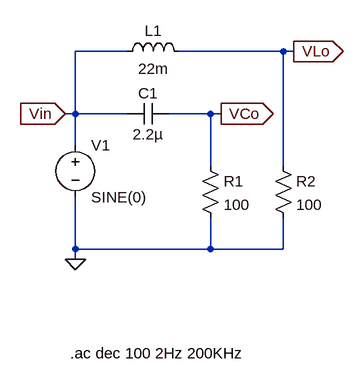
[diagram p0: schematic Passive Filters.asc]
Passive Filters.asc, the LTspice schematic file:
Version 4
SHEET 1 880 680
WIRE 208 128 128 128
WIRE 448 128 288 128
WIRE 464 128 448 128
WIRE 128 224 128 128
WIRE 128 224 112 224
WIRE 208 224 128 224
WIRE 336 224 272 224
WIRE 352 224 336 224
WIRE 128 272 128 224
WIRE 336 304 336 224
WIRE 448 304 448 128
WIRE 128 432 128 352
WIRE 336 432 336 384
WIRE 336 432 128 432
WIRE 448 432 448 384
WIRE 448 432 336 432
WIRE 128 448 128 432
FLAG 128 448 0
FLAG 352 224 VCo
IOPIN 352 224 Out
FLAG 464 128 VLo
IOPIN 464 128 Out
FLAG 112 224 Vin
IOPIN 112 224 In
SYMBOL voltage 128 256 R0
SYMATTR InstName V1
SYMATTR Value SINE(0)
SYMATTR Value2 AC 3V
SYMBOL ind 192 144 R270
WINDOW 0 32 56 VTop 2
WINDOW 3 5 56 VBottom 2
SYMATTR InstName L1
SYMATTR Value 22m
SYMATTR SpiceLine Ipk=190m Rser=14.448 Rpar=2.0724Meg Cpar=0 mfg="Coilcraft" pn="PCH-45X-226"
SYMBOL cap 272 208 R90
WINDOW 0 0 32 VBottom 2
WINDOW 3 32 32 VTop 2
SYMATTR InstName C1
SYMATTR Value 2.2µ
SYMATTR SpiceLine Rser=0
SYMBOL res 320 288 R0
SYMATTR InstName R1
SYMATTR Value 100
SYMBOL res 432 288 R0
SYMATTR InstName R2
SYMATTR Value 100
TEXT 120 592 Left 2 !.ac dec 100 2Hz 200KHz

The netlist it stands for:
* Passive Filters.asc
V1 Vin 0 SINE(0) AC 3V
L1 Vin VLo 22m Ipk=190m Rser=14.448 Rpar=2.0724Meg Cpar=0 mfg="Coilcraft" pn="PCH-45X-226"
C1 VCo Vin 2.2µ Rser=0
R1 VCo 0 100
R2 VLo 0 100
.ac dec 100 2Hz 200KHz
.backanno
.end